# Altium project heli_base.PrjPCB
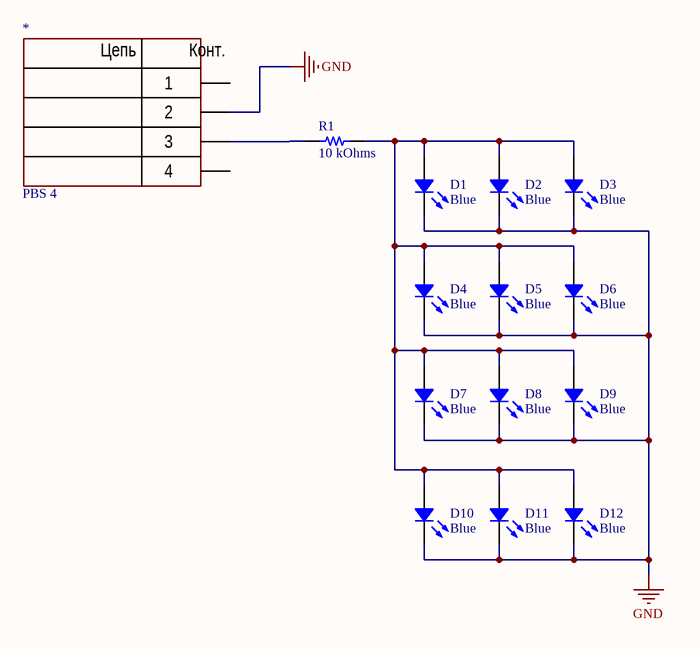
[diagram p0: Sheet1.SchDoc]
1 sheet, 14 parts. Net scope: global (net labels, ports and power ports of the same name join across sheets).
Board file: heli_pcb.PcbDoc

## Sheet Sheet1.SchDoc
size A4

### Parts
*  PBS 4  [PBS-4 CUT]
D1  Blue  [LED 0603_1608 BLUE]
D2  Blue  [LED 0603_1608 BLUE]
D3  Blue  [LED 0603_1608 BLUE]
D4  Blue  [LED 0603_1608 BLUE]
D5  Blue  [LED 0603_1608 BLUE]
D6  Blue  [LED 0603_1608 BLUE]
D7  Blue  [LED 0603_1608 BLUE]
D8  Blue  [LED 0603_1608 BLUE]
D9  Blue  [LED 0603_1608 BLUE]
D10  Blue  [LED 0603_1608 BLUE]
D11  Blue  [LED 0603_1608 BLUE]
D12  Blue  [LED 0603_1608 BLUE]
R1  10 kOhms  [RES 0603_1608]

### Nets
GND: *.2 D1.2 D2.2 D3.2 D4.2 D5.2 D6.2 D7.2 D8.2 D9.2 D10.2 D11.2 D12.2
Net*_3: *.3 R1.1
NetD1_1: D1.1 D2.1 D3.1 D4.1 D5.1 D6.1 D7.1 D8.1 D9.1 D10.1 D11.1 D12.1 R1.2

Not connected (* = marked no-connect by the designer): * 1 4

### Notes on the sheet
- (in symbol PBS 4) Цепь; Конт.

### Library data of the parts
D1-D12 = APT1608VBC/D: LED BLUE CLEAR CHIP SMD; Manufacturer: Kingbright; Configuration: Standard; Current - Test: 20mA; Lens Color: Colorless; Lens Size: 1.20mm x 0.80mm; Lens Style: Rectangle with Flat Top; Millicandela Rating: 180mcd; Viewing Angle: 120°; Voltage - Forward (Vf) (Typ): 3.3V; Wavelength - Dominant: 470nm; Wavelength - Peak: 465nm; Part Number: APT1608VBC/D; Color: Blue; ComponentLink1Description: Datasheet; ComponentLink1URL: http://www.kingbrightusa.com/images/catalog/SPEC/APT1608VBC-D.pdf; ComponentLink2Description: DigiKey Link; ComponentLink2URL: http://digikey.com/product-detail/en/kingbright/APT1608VBC-D/754-1789-1-ND/4753613; Device Package: 0603 (1608 Metric); Height (Max): 0.75mm; LastUpdated: 21.01.2020 3:10:55; Lens Transparency: Clear; Lifecycle Status: Active; Minimum Order: 1; Mounting Type: Surface Mount; Package / Case: 0603 (1608 Metric); Packaging: TapeAndReel; PartId: 844; Part Status: Active; Price: 0.16; Series: -; Size / Dimension: 1.60mm L x 0.80mm W; Supplier 1: DigiKey; Supplier Part Number 1: 754-1789-1-ND; Supplier Device Package: Chip LED; Value: Blue
R1 = RNCS0603BKE10K0: RES 10K OHM 0.1% 1/16W 0603; Manufacturer: Stackpole Electronics Inc; Power (Watts): 0.063W, 1/16W; Temperature Coefficient: ±25ppm/°C; Part Number: RNCS0603BKE10K0; Value: 10 kOhms; ComponentLink1Description: Datasheet; ComponentLink1URL: https://www.seielect.com/catalog/sei-rncs_rnch.pdf; ComponentLink2Description: DigiKey Link; ComponentLink2URL: http://digikey.com/product-detail/en/stackpole-electronics-inc/RNCS0603BKE10K0/RNCS0603BKE10K0CT-ND/1800113; Composition: Thin Film; Device Package: 0603 (1608 Metric); Features: Anti-Corrosive, Automotive AEC-Q200, Moisture Resistant; Height - Seated (Max): 0.022" (0.55mm); LastUpdated: 21.01.2020 0:25:01; Lifecycle Status: Active; Minimum Order: 1; Number of Terminations: 2; Operating Temperature: -55°C ~ 155°C; Package / Case: 0603 (1608 Metric); Packaging: TapeAndReel; PartId: 4838; Part Status: Active; Price: 0.08; Ratings: AEC-Q200; Resistance: 10 kOhms; Series: RNCS; Size / Dimension: 0.061" L x 0.031" W (1.55mm x 0.80mm); Supplier 1: DigiKey; Supplier Part Number 1: RNCS0603BKE10K0CT-ND; Supplier Device Package: 0603; Tolerance: ±0.1%